# Altium project mcudevkit.PrjPcb (part 1 of 3)
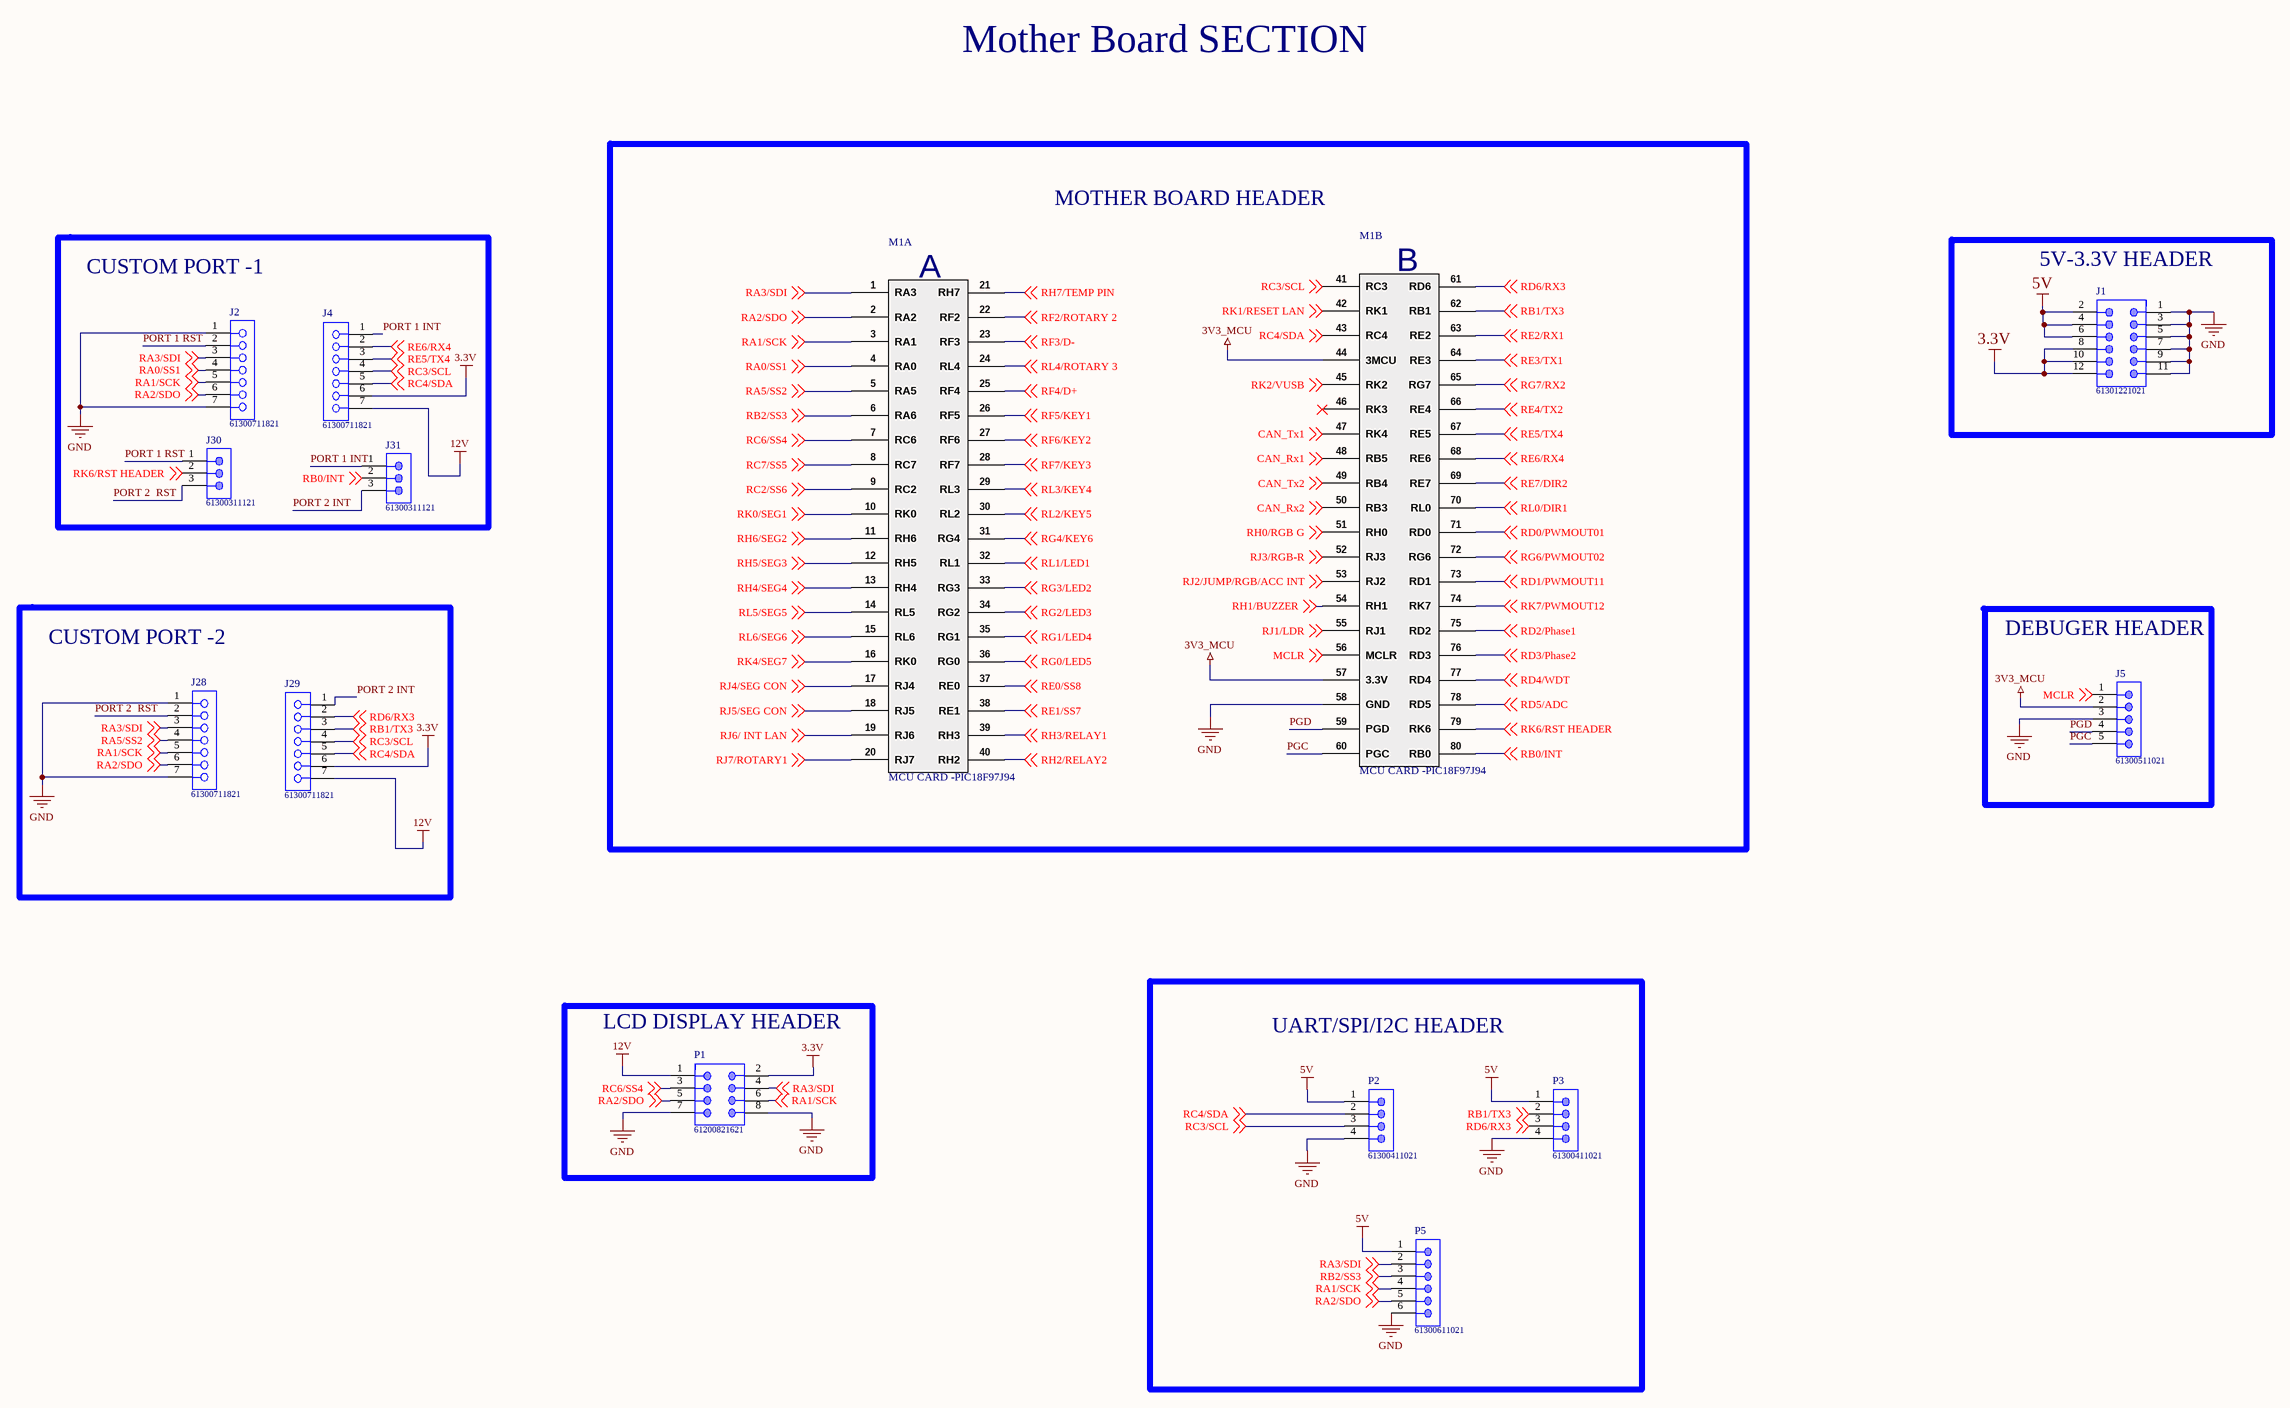
[diagram p0: Motherboard.SchDoc]
22 sheets, 236 parts. Net scope: global (net labels, ports and power ports of the same name join across sheets).
Board files: MB V2.PcbDoc, MB V3.PcbDoc, MB V7.PcbDoc
Sheets:
  Motherboard.SchDoc
  relaymodule.SchDoc
  stepper_motodriver.SchDoc
  matrixkeypad.SchDoc
  powersupply.SchDoc
  7segment.SchDoc
  Rtc.SchDoc
  Usb to Uart.SchDoc
  SPI FLASH.SchDoc
  RS-485.SchDoc
  DAC SPI.SchDoc
  Lan.SchDoc
  I2C EXTERNAL.SchDoc
  wwdt.SchDoc
  CAN.SchDoc
  DIGITAL POT.SchDoc
  Rotary Encoder.SchDoc
  USB.SchDoc
  ACCELEROMETER.SchDoc
  Current SENSOR.SchDoc
  OPAMP.SchDoc
  BARTGL.SchDoc

## Sheet Motherboard.SchDoc
size A2; SheetNumber: 1; SheetTotal: 22

### Parts
J1  61301221021  [61301221021]
J2  61300711821  [61300711821]
J4  61300711821  [61300711821]
J5  61300511021  [61300511021]
J28  61300711821  [61300711821]
J29  61300711821  [61300711821]
J30  61300311121  [61300311121]
J31  61300311121  [61300311121]
M1  MCU CARD -PIC18F97J94  [MCU-Card-PIC18f97j94]  (parts A,B of 2)
P1  61200821621  [61200821621]
P2  61300411021  [61300411021]
P3  61300411021  [61300411021]
P5  61300611021  [61300611021]

### Blocks framed on the sheet
MOTHER BOARD HEADER: M1
CUSTOM PORT -1: J2 J4 J30 J31
5V-3.3V HEADER: J1
CUSTOM PORT -2: J28 J29
DEBUGER HEADER: J5
LCD DISPLAY HEADER: P1
UART/SPI/I2C HEADER: P2 P3 P5

### Nets
3.3V: J1.8 J1.10 J1.12 J4.6 J29.6 P1.2
3V3_MCU: J5.2 M1.44(3MCU) M1.57(3.3V)
5V: J1.2 J1.4 J1.6 P2.1 P3.1 P5.1
12V: J4.7 J29.7 P1.1
GND: J1.1 J1.3 J1.5 J1.7 J1.9 J1.11 J2.1 J2.7 J5.3 J28.1 J28.7 M1.58(GND) P1.7 P1.8 P2.4 P3.4 P5.6
CAN_Rx1: M1.48(RB5) ; off-sheet CAN_Rx1
CAN_Rx2: M1.50(RB3) ; off-sheet CAN_Rx2
CAN_Tx1: M1.47(RK4) ; off-sheet CAN_Tx1
CAN_Tx2: M1.49(RB4) ; off-sheet CAN_Tx2
MCLR: J5.1 M1.56(MCLR) ; off-sheet MCLR
PGC: J5.5 M1.60(PGC)
PGD: J5.4 M1.59(PGD)
PORT 1 INT: J4.1 J31.1
PORT 1 RST: J2.2 J30.1
PORT 2  RST: J28.2 J30.3
PORT 2 INT: J29.1 J31.3
RA0/SS1: J2.4 M1.4(RA0) ; off-sheet RA0/SS1
RA1/SCK: J2.5 J28.5 M1.3(RA1) P1.6 P5.4 ; off-sheet RA1/SCK
RA2/SDO: J2.6 J28.6 M1.2(RA2) P1.5 P5.5 ; off-sheet RA2/SDO
RA3/SDI: J2.3 J28.3 M1.1(RA3) P1.4 P5.2 ; off-sheet RA3/SDI
RA5/SS2: J28.4 M1.5(RA5) ; off-sheet RA5/SS2
RB0/INT: J31.2 M1.80(RB0) ; off-sheet RB0/INT
RB1/TX3: J29.3 M1.62(RB1) P3.2 ; off-sheet RB1/TX3
RB2/SS3: M1.6(RA6) P5.3 ; off-sheet RB2/SS3
RC2/SS6: M1.9(RC2) ; off-sheet RC2/SS6
RC3/SCL: J4.4 J29.4 M1.41(RC3) P2.3 ; off-sheet RC3/SCL
RC4/SDA: J4.5 J29.5 M1.43(RC4) P2.2 ; off-sheet RC4/SDA
RC6/SS4: M1.7(RC6) P1.3 ; off-sheet RC6/SS4
RC7/SS5: M1.8(RC7) ; off-sheet RC7/SS5
RD0/PWMOUT01: M1.71(RD0) ; off-sheet RD0/PWMOUT01
RD1/PWMOUT11: M1.73(RD1) ; off-sheet RD1/PWMOUT11
RD2/Phase1: M1.75(RD2) ; off-sheet RD2/Phase1
RD3/Phase2: M1.76(RD3) ; off-sheet RD3/Phase2
RD4/WDT: M1.77(RD4) ; off-sheet RD4/WDT
RD5/ADC: M1.78(RD5) ; off-sheet RD5/ADC
RD6/RX3: J29.2 M1.61(RD6) P3.3 ; off-sheet RD6/RX3
RE0/SS8: M1.37(RE0) ; off-sheet RE0/SS8
RE1/SS7: M1.38(RE1) ; off-sheet RE1/SS7
RE2/RX1: M1.63(RE2) ; off-sheet RE2/RX1
RE3/TX1: M1.64(RE3) ; off-sheet RE3/TX1
RE4/TX2: M1.66(RE4) ; off-sheet RE4/TX2
RE5/TX4: J4.3 M1.67(RE5) ; off-sheet RE5/TX4
RE6/RX4: J4.2 M1.68(RE6) ; off-sheet RE6/RX4
RE7/DIR2: M1.69(RE7) ; off-sheet RE7/DIR2
RF2/ROTARY 2: M1.22(RF2) ; off-sheet RF2/ROTARY 2
RF3/D-: M1.23(RF3) ; off-sheet RF3/D-
RF4/D+: M1.25(RF4) ; off-sheet RF4/D+
RF5/KEY1: M1.26(RF5) ; off-sheet RF5/KEY1
RF6/KEY2: M1.27(RF6) ; off-sheet RF6/KEY2
RF7/KEY3: M1.28(RF7) ; off-sheet RF7/KEY3
RG0/LED5: M1.36(RG0) ; off-sheet RG0/LED5
RG1/LED4: M1.35(RG1) ; off-sheet RG1/LED4
RG2/LED3: M1.34(RG2) ; off-sheet RG2/LED3
RG3/LED2: M1.33(RG3) ; off-sheet RG3/LED2
RG4/KEY6: M1.31(RG4) ; off-sheet RG4/KEY6
RG6/PWMOUT02: M1.72(RG6) ; off-sheet RG6/PWMOUT02
RG7/RX2: M1.65(RG7) ; off-sheet RG7/RX2
RH0/RGB G: M1.51(RH0) ; off-sheet RH0/RGB G
RH1/BUZZER: M1.54(RH1) ; off-sheet RH1/BUZZER
RH2/RELAY2: M1.40(RH2) ; off-sheet RH2/RELAY2
RH3/RELAY1: M1.39(RH3) ; off-sheet RH3/RELAY1
RH4/SEG4: M1.13(RH4) ; off-sheet RH4/SEG4
RH5/SEG3: M1.12(RH5) ; off-sheet RH5/SEG3
RH6/SEG2: M1.11(RH6) ; off-sheet RH6/SEG2
RH7/TEMP PIN: M1.21(RH7) ; off-sheet RH7/TEMP PIN
RJ1/LDR: M1.55(RJ1) ; off-sheet RJ1/LDR
RJ2/JUMP/RGB/ACC INT: M1.53(RJ2) ; off-sheet RJ2/JUMP/RGB/ACC INT
RJ3/RGB-R: M1.52(RJ3) ; off-sheet RJ3/RGB-R
RJ4/SEG CON: M1.17(RJ4) ; off-sheet RJ4/SEG CON
RJ5/SEG CON: M1.18(RJ5) ; off-sheet RJ5/SEG CON
RJ6/ INT LAN: M1.19(RJ6) ; off-sheet RJ6/ INT LAN
RJ7/ROTARY1: M1.20(RJ7) ; off-sheet RJ7/ROTARY1
RK0/SEG1: M1.10(RK0) ; off-sheet RK0/SEG1
RK1/RESET LAN: M1.42(RK1) ; off-sheet RK1/RESET LAN
RK2/VUSB: M1.45(RK2) ; off-sheet RK2/VUSB
RK4/SEG7: M1.16(RK0) ; off-sheet RK4/SEG7
RK6/RST HEADER: J30.2 M1.79(RK6) ; off-sheet RK6/RST HEADER
RK7/PWMOUT12: M1.74(RK7) ; off-sheet RK7/PWMOUT12
RL0/DIR1: M1.70(RL0) ; off-sheet RL0/DIR1
RL1/LED1: M1.32(RL1) ; off-sheet RL1/LED1
RL2/KEY5: M1.30(RL2) ; off-sheet RL2/KEY5
RL3/KEY4: M1.29(RL3) ; off-sheet RL3/KEY4
RL4/ROTARY 3: M1.24(RL4) ; off-sheet RL4/ROTARY 3
RL5/SEG5: M1.14(RL5) ; off-sheet RL5/SEG5
RL6/SEG6: M1.15(RL6) ; off-sheet RL6/SEG6

Not connected (* = marked no-connect by the designer): M1 46(RK3)*

### Notes on the sheet
- Mother Board SECTION
- (in symbol MCU CARD -PIC18F97J94, part A) A
- (in symbol MCU CARD -PIC18F97J94, part B) B

### Library data of the parts
J1 = 61301221021: WR-PHD Pin Header, THT, pitch 2.54mm, Dual Row, Angled, 12pin; Pin Number: 12; Gender: Male; Rated Current: 3A; Working Voltage: 250VAC; Withstanding Voltage: 500VAC; Contact Resistance: 20mOhm; ComponentLink1Description: Manufacturer; ComponentLink1URL: http://www.we-online.de; ComponentLink2Description: Datasheet; ComponentLink2URL: https://katalog.we-online.de/em/datasheet/6130xx21021.pdf; Part Number: 61301221021; Published Date: June 2019; Publisher: Wurth Elektronik; Pitch: 2.54mm; Operating Temperature: -40 to +105degC; Mounting Technology: THT; Packaging: Bag; Row Number: Dual; Orientation: Angled
J2 J4 J28 J29 = 61300711821: WR-PHD Socket Header, THT, pitch 2.54mm, Single Row, Vertical, 7pin; Pin Number: 7; Gender: Female; Rated Current: 3A; Working Voltage: 250VAC; Withstanding Voltage: 500VAC; Contact Resistance: 20mOhm; ComponentLink1Description: Manufacturer; ComponentLink1URL: http://www.we-online.de; ComponentLink2Description: Datasheet; ComponentLink2URL: https://katalog.we-online.de/em/datasheet/6130xx11821.pdf; Part Number: 61300711821; Published Date: June 2019; Publisher: Wurth Elektronik; Pitch: 2.54mm; Operating Temperature: -40 to +125degC; Mounting Technology: THT; Packaging: Tray; Row Number: Single; Orientation: Vertical
J5 = 61300511021: WR-PHD Pin Header, THT, pitch 2.54mm, Single Row, Angled, 5pin; Pin Number: 5; Gender: Male; Rated Current: 3A; Working Voltage: 250VAC; Withstanding Voltage: 500VAC; Contact Resistance: 20mOhm; ComponentLink1Description: Manufacturer; ComponentLink1URL: http://www.we-online.de; ComponentLink2Description: Datasheet; ComponentLink2URL: https://katalog.we-online.de/em/datasheet/6130xx11021.pdf; Part Number: 61300511021; Published Date: June 2019; Publisher: Wurth Elektronik; Pitch: 2.54mm; Operating Temperature: -40 to +105degC; Mounting Technology: THT; Packaging: Bag; Row Number: Single; Orientation: Angled
J30 J31 = 61300311121: WR-PHD Pin Header, THT, pitch 2.54mm, Single Row, Vertical, 3pin; Pin Number: 3; Gender: Male; Rated Current: 3A; Working Voltage: 250VAC; Withstanding Voltage: 500VAC; Contact Resistance: 20mOhm; ComponentLink1Description: Manufacturer; ComponentLink1URL: http://www.we-online.de; ComponentLink2Description: Datasheet; ComponentLink2URL: https://katalog.we-online.de/em/datasheet/6130xx11121.pdf; Part Number: 61300311121; Published Date: June 2019; Publisher: Wurth Elektronik; Pitch: 2.54mm; Operating Temperature: -40 to +105degC; Mounting Technology: THT; Packaging: Bag; Row Number: Single; Orientation: Vertical
M1 = MCU CARD -PIC18F97J94: MCU CARD -PIC18F97J94 FOR mother board
P1 = 61200821621: Male Box Header WR-BHD, THT, Vertical, pitch 2.54 mm, 8 pins; Pitch: 2.54 mm; Working Voltage: 250 VAC; Withstanding Voltage: 500 VAC; Contact Resistance: 20 mOhm; Pin Number: 8; ComponentLink1Description: Manufacturer; ComponentLink1URL: http://www.we-online.de; ComponentLink2Description: Datasheet; ComponentLink2URL: https://katalog.we-online.de/em/datasheet/6120xx21621.pdf; Part Number: 61200821621; Published Date: August 2018; Publisher: Wurth Elektronik; Operating Temperature: -40 to 125 degC; Packaging: Tray; Gender: Male; Mounting Technology: THT; Orientation: Vertical
P2 P3 = 61300411021: WR-PHD Pin Header, THT, pitch 2.54mm, Single Row, Angled, 4pin; Pin Number: 4; Gender: Male; Rated Current: 3A; Working Voltage: 250VAC; Withstanding Voltage: 500VAC; Contact Resistance: 20mOhm; ComponentLink1Description: Manufacturer; ComponentLink1URL: http://www.we-online.de; ComponentLink2Description: Datasheet; ComponentLink2URL: https://katalog.we-online.de/em/datasheet/6130xx11021.pdf; Part Number: 61300411021; Published Date: June 2019; Publisher: Wurth Elektronik; Pitch: 2.54mm; Operating Temperature: -40 to +105degC; Mounting Technology: THT; Packaging: Bag; Row Number: Single; Orientation: Angled
P5 = 61300611021: WR-PHD Pin Header, THT, pitch 2.54mm, Single Row, Angled, 6pin; Pin Number: 6; Gender: Male; Rated Current: 3A; Working Voltage: 250VAC; Withstanding Voltage: 500VAC; Contact Resistance: 20mOhm; ComponentLink1Description: Manufacturer; ComponentLink1URL: http://www.we-online.de; ComponentLink2Description: Datasheet; ComponentLink2URL: https://katalog.we-online.de/em/datasheet/6130xx11021.pdf; Part Number: 61300611021; Published Date: June 2019; Publisher: Wurth Elektronik; Pitch: 2.54mm; Operating Temperature: -40 to +105degC; Mounting Technology: THT; Packaging: Bag; Row Number: Single; Orientation: Angled

## Sheet relaymodule.SchDoc
size 250 x 250 mm; SheetNumber: 2; SheetTotal: 22
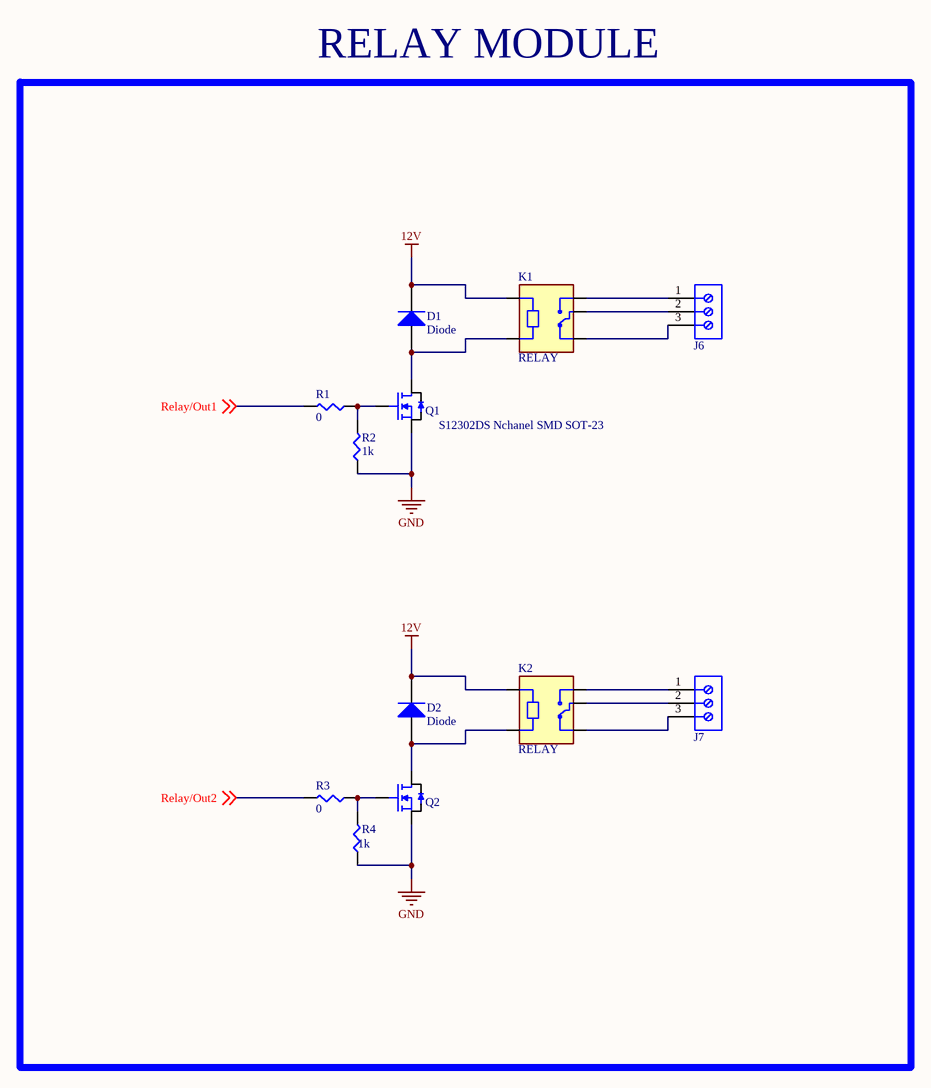
[diagram p1: relaymodule.SchDoc]

### Parts
D1  Diode  [SMC]
D2  Diode  [SMC]
J6  691101710003  [691101710003]  (value not drawn)
J7  691101710003  [691101710003]  (value not drawn)
K1  RELAY  [RELAY]
K2  RELAY  [RELAY]
Q1  S12302DS Nchanel SMD SOT-23  [SOT-23-3N]
Q2  S12302DS Nchanel SMD SOT-23  [SOT-23-3N]  (value not drawn)
R1  0  [SMD-0805-RES]
R2  1k  [SMD-0805-RES]
R3  0  [SMD-0805-RES]
R4  1k  [SMD-0805-RES]

### Blocks framed on the sheet
RELAY MODULE: D1 D2 J6 J7 K1 K2 Q1 Q2 R1-R4

### Nets
12V: D1.2(K) D2.2(K) K1.A1 K2.A1
GND: Q1.2(Source) Q2.2(Source) R2.1 R4.1
Relay/Out1: R1.2 ; off-sheet Relay/Out1
Relay/Out2: R3.2 ; off-sheet Relay/Out2
NetD1_1: D1.1(A) K1.A2 Q1.3(Drain)
NetD2_1: D2.1(A) K2.A2 Q2.3(Drain)
NetJ6_1: J6.1 K1.NO
NetJ6_2: J6.2 K1.COM
NetJ6_3: J6.3 K1.NC
NetJ7_1: J7.1 K2.NO
NetJ7_2: J7.2 K2.COM
NetJ7_3: J7.3 K2.NC
NetQ1_1: Q1.1(Gate) R1.1 R2.2
NetQ2_1: Q2.1(Gate) R3.1 R4.2

### Library data of the parts
D1 D2 = Diode: Default Diode; Published: 8-Jun-2000; LatestRevisionDate: 17-Jul-2002; LatestRevisionNote: Re-released for DXP Platform.; PackageVersion: Sep-1996; PackageReference: SMC; Publisher: Altium Limited; PackageDescription: DO-214-AB/SMC; 2 C-Bend Leads; Body 7.9 x 5.9 mm, inc. leads (LxW); Code_JEDEC: DO-214-AB
J6 J7 = 691101710003: WR-TBL Series 101 Horizontal Entry Modular, THT, pitch 5mm, 3p; Manufacturer: Wurth Elektronik; Modularity: Yes; Rated Current: 16A; Working Voltage: 250V; ComponentLink1Description: Website Link; ComponentLink1URL: https://www.we-online.com/redexpert/article/691101710003?ad; ComponentLink2Description: Datasheet Link; ComponentLink2URL: https://www.we-online.com/redexpert/spec/691101710003?ad; Manufacturer Part Number: 691101710003; Category: Terminal Blocks; Match Code: WR-TBL; Mount: Through Hole; Operating Temperature Max: 105°C; Operating Temperature Min: -40°C; Packaging: Box; Application: Pressure Clamp; Number of Pins: 3; Number of Rows: 1; Orientation: Horizontal; Pitch: 5mm
Q1 Q2 = S12302DS: S12302DS Nchanel SMD SOT-23. VDS MAX 20. 400Ma DI
R1 R3 = ERJ-6ENF1001V: RES SMD 1K OHM 1% 1/8W 0805; Manufacturer: Panasonic Electronic Components; Unit Price (USD): 0.00729; @ qty: 1500; Minimum Quantity: 1; Power (Watts): 0.125W, 1/8W; Temperature Coefficient: ±100ppm/°C; Part Number: ERJ-6ENF1001V; Datasheets: http://industrial.panasonic.com/www-cgi/jvcr13pz.cgi?E+PZ+3+AOA0002+ERJ6ENF1001V+7+WW; Image: //media.digikey.com/Renders/Panasonic%20Renders/ERJ-0805%20Pkg.jpg; Digi-Key Part Number: P1.00KCCT-ND; Quantity Available: 12895103; Factory Stock: 0; Packaging: Cut Tape (CT); Series: ERJ; Part Status: Active; Value: 1k; Tolerance: ±1%; Composition: Thick Film; Features: Automotive AEC-Q200; Operating Temperature: -55°C ~ 155°C; Package / Case: 0805 (2012 Metric); Supplier Device Package: 0805; Size / Dimension: 0.079" L x 0.049" W (2.00mm x 1.25mm); Height - Seated (Max): 0.028" (0.70mm); Number of Terminations: 2; Failure Rate: -
R2 R4 = ERJ-6ENF1001V: RES SMD 1K OHM 1% 1/8W 0805; Manufacturer: Panasonic Electronic Components; Factory Stock: 0; Unit Price (USD): 0.00729; @ qty: 1500; Minimum Quantity: 1; Power (Watts): 0.125W, 1/8W; Temperature Coefficient: ±100ppm/°C; Part Number: ERJ-6ENF1001V; Datasheets: http://industrial.panasonic.com/www-cgi/jvcr13pz.cgi?E+PZ+3+AOA0002+ERJ6ENF1001V+7+WW; Image: //media.digikey.com/Renders/Panasonic%20Renders/ERJ-0805%20Pkg.jpg; Digi-Key Part Number: P1.00KCCT-ND; Quantity Available: 12895103; Packaging: Cut Tape (CT); Series: ERJ; Part Status: Active; Value: 1k; Tolerance: ±1%; Composition: Thick Film; Features: Automotive AEC-Q200; Operating Temperature: -55°C ~ 155°C; Package / Case: 0805 (2012 Metric); Supplier Device Package: 0805; Size / Dimension: 0.079" L x 0.049" W (2.00mm x 1.25mm); Height - Seated (Max): 0.028" (0.70mm); Number of Terminations: 2; Failure Rate: -

## Sheet stepper_motodriver.SchDoc
size A4; SheetNumber: 3; SheetTotal: 22
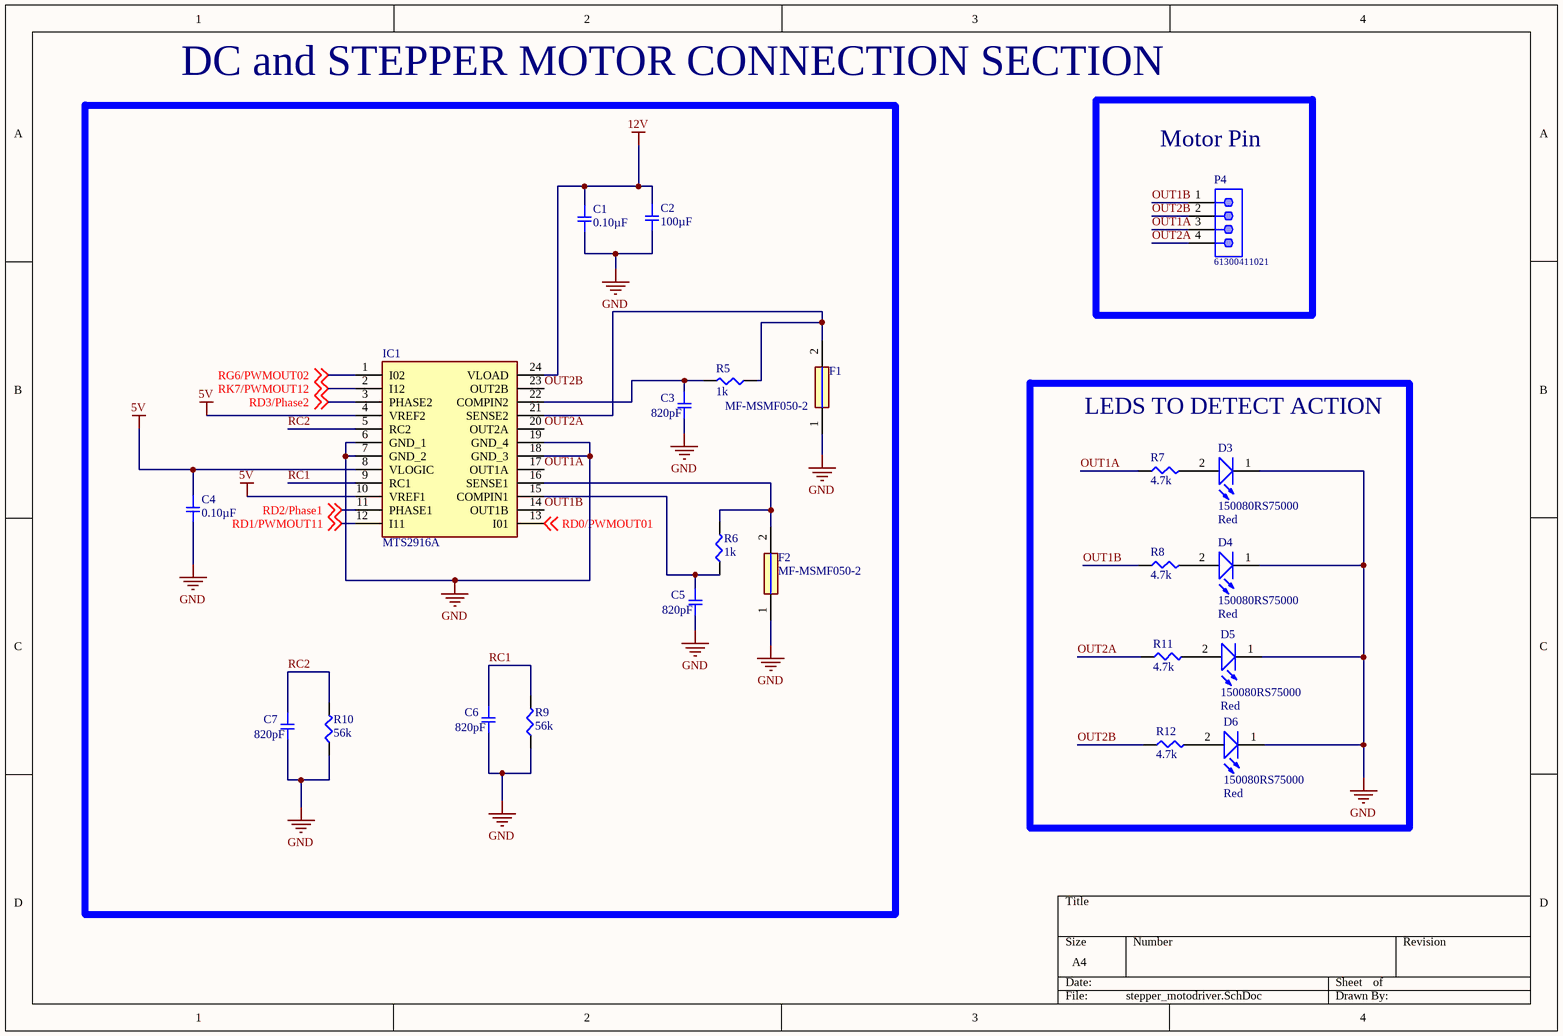
[diagram p2: stepper_motodriver.SchDoc]

### Parts
C1  0.10µF  [SMD-0805C]
C2  100µF  [SMD-0805C]
C3  820pF  [SMD-0805C]
C4  0.10µF  [SMD-0805C]
C5  820pF  [SMD-0805C]
C6  820pF  [SMD-0805C]
C7  820pF  [SMD-0805C]
D3  150080RS75000  Emitting Color: Red  [WL-SMCW_0805]
D4  150080RS75000  Emitting Color: Red  [WL-SMCW_0805]
D5  150080RS75000  Emitting Color: Red  [WL-SMCW_0805]
D6  150080RS75000  Emitting Color: Red  [WL-SMCW_0805]
F1  MF-MSMF050-2  [FUSC4632X85N]
F2  MF-MSMF050-2  [FUSC4632X85N]
IC1  MTS2916A  [SOIC127P1046X264-24N]
P4  61300411021  [61300411021]
R5  1k  [SMD-0805-RES]
R6  1k  [SMD-0805-RES]
R7  4.7k  [SMD-0805-RES]
R8  4.7k  [SMD-0805-RES]
R9  56k  [SMD-0805-RES]
R10  56k  [SMD-0805-RES]
R11  4.7k  [SMD-0805-RES]
R12  4.7k  [SMD-0805-RES]

### Blocks framed on the sheet
DC and STEPPER MOTOR CONNECTION SECTION: C1-C7 F1 F2 IC1 R5 R6 R9 R10
Motor Pin: P4
LEDS TO DETECT ACTION: D3-D6 R7 R8 R11 R12

### Nets
5V: C4.1 IC1.4(VREF2) IC1.8(VLOGIC) IC1.10(VREF1)
12V: C1.1 C2.1 IC1.24(VLOAD)
GND: C1.2 C2.2 C3.2 C4.2 C5.2 C6.2 C7.2 D3.1(K) D4.1(K) D5.1(K) D6.1(K) F1.1 F2.1 IC1.6(GND_1) IC1.7(GND_2) IC1.18(GND_3) IC1.19(GND_4) R9.1 R10.1
OUT1A: IC1.17(OUT1A) P4.3 R7.1
OUT1B: IC1.14(OUT1B) P4.1 R8.1
OUT2A: IC1.20(OUT2A) P4.4 R11.1
OUT2B: IC1.23(OUT2B) P4.2 R12.1
RC1: C6.1 IC1.9(RC1) R9.2
RC2: C7.1 IC1.5(RC2) R10.2
RD0/PWMOUT01: IC1.13(I01) ; off-sheet RD0/PWMOUT01
RD1/PWMOUT11: IC1.12(I11) ; off-sheet RD1/PWMOUT11
RD2/Phase1: IC1.11(PHASE1) ; off-sheet RD2/Phase1
RD3/Phase2: IC1.3(PHASE2) ; off-sheet RD3/Phase2
RG6/PWMOUT02: IC1.1(I02) ; off-sheet RG6/PWMOUT02
RK7/PWMOUT12: IC1.2(I12) ; off-sheet RK7/PWMOUT12
NetC3_1: C3.1 IC1.22(COMPIN2) R5.2
NetC5_1: C5.1 IC1.15(COMPIN1) R6.1
NetD3_2: D3.2(A) R7.2
NetD4_2: D4.2(A) R8.2
NetD5_2: D5.2(A) R11.2
NetD6_2: D6.2(A) R12.2
NetF1_2: F1.2 IC1.21(SENSE2) R5.1
NetF2_2: F2.2 IC1.16(SENSE1) R6.2

### Library data of the parts
C1 C4 = GCD21BR71H104KA01L: CAP CER 0.1UF 50V X7R 0805; Manufacturer: Murata Electronics North America; Factory Stock: 0; Unit Price (USD): 0.24; Minimum Quantity: 1; Tolerance: ±10%; Datasheets: http://www.murata.com/~/media/webrenewal/support/library/catalog/products/capacitor/mlcc/c03e.ashx; Image: //media.digikey.com/Renders/Murata%20Renders/0805%28GxM6%29.jpg; Digi-Key Part Number: 490-11955-1-ND; Part Number: GCD21BR71H104KA01L; Quantity Available: 157; @ qty: 0; Packaging: Cut Tape (CT); Series: GCD; Part Status: Active; Value: 0.10µF; Voltage: 50V; Temperature Coefficient: X7R; Operating Temperature: -55°C ~ 125°C; Features: -; Ratings: AEC-Q200; Applications: Automotive; Mounting Type: Surface Mount, MLCC; Package / Case: 0805 (2012 Metric); Size / Dimension: 0.079" L x 0.049" W (2.00mm x 1.25mm); Height - Seated (Max): -; Thickness (Max): 0.049" (1.25mm); Lead Spacing: -; Lead Style: -
C2 = GRM21BR60J107ME15L: CAP CER 100UF 6.3V X5R 0805; Manufacturer: Murata Electronics North America; Factory Stock: 0; Unit Price (USD): 2.17; Minimum Quantity: 1; Tolerance: ±20%; Datasheets: http://search.murata.co.jp/Ceramy/image/img/A01X/G101/ENG/GRM21BR60J107ME15-01.pdf; Image: //media.digikey.com/Renders/Murata%20Renders/0805%20(2012%20Metric)%20.85mm.jpg; Digi-Key Part Number: 490-13981-1-ND; Part Number: GRM21BR60J107ME15L; Quantity Available: 4815; @ qty: 0; Packaging: Cut Tape (CT); Series: GRM; Part Status: Active; Value: 100µF; Voltage: 6.3V; Temperature Coefficient: X5R; Operating Temperature: -55°C ~ 85°C; Features: -; Ratings: -; Applications: General Purpose; Mounting Type: Surface Mount, MLCC; Package / Case: 0805 (2012 Metric); Size / Dimension: 0.079" L x 0.049" W (2.00mm x 1.25mm); Height - Seated (Max): -; Thickness (Max): 0.057" (1.45mm); Lead Spacing: -; Lead Style: -
C3 C5-C7 = GRM2165C1H821JA01D: CAP CER 820PF 50V NP0 0805; Manufacturer: Murata Electronics North America; Factory Stock: 0; Unit Price (USD): 0.21; Minimum Quantity: 1; Tolerance: ±5%; Temperature Coefficient: C0G, NP0; Datasheets: http://www.murata.com/~/media/webrenewal/support/library/catalog/products/capacitor/mlcc/c02e.pdf; Image: //media.digikey.com/Renders/Murata%20Renders/0805%20(2012%20Metric)%20.85mm.jpg; Digi-Key Part Number: 490-11551-1-ND; Part Number: GRM2165C1H821JA01D; Quantity Available: 17274; @ qty: 0; Packaging: Cut Tape (CT); Series: GRM; Part Status: Active; Value: 820pF; Voltage: 50V; Operating Temperature: -55°C ~ 125°C; Features: -; Ratings: -; Applications: General Purpose; Mounting Type: Surface Mount, MLCC; Package / Case: 0805 (2012 Metric); Size / Dimension: 0.079" L x 0.049" W (2.00mm x 1.25mm); Height - Seated (Max): -; Thickness (Max): 0.028" (0.70mm); Lead Spacing: -; Lead Style: -
D3-D6 = 150080RS75000: WL-SMCW SMD Mono-color Chip LED Waterclear, size 0805, Red; Forward Voltage: 2 V; Viewing Angle: 140°; Peak Wavelength: 630 nm; Published Date: Jan 2017; Publisher: Wurth Elektronik; ComponentLink1Description: Manufacturer; ComponentLink1URL: http://www.we-online.de; ComponentLink2Description: Datasheet; ComponentLink2URL: http://katalog.we-online.de/led/datasheet/150080RS75000.pdf; Part Number: 150080RS75000; Size: 0805
F1 F2 = MF-MSMF050-2: Fuse; Manufacturer_Name: Bourns; Datasheet Link: https://www.bourns.com/pdfs/mfmsmf.pdf; Manufacturer_Part_Number: MF-MSMF050-2; Mouser Part Number: 652-MF-MSMF050-2; Mouser Price/Stock: https://www.mouser.co.uk/ProductDetail/Bourns/MF-MSMF050-2?qs=t3shhpq1i1DZ7OBD5kLNoA%3D%3D; Arrow Part Number: MF-MSMF050-2; Arrow Price/Stock: https://www.arrow.com/en/products/mf-msmf050-2/bourns?region=europe
IC1 = MTS2916A-HGC1: Integrated Circuit; Manufacturer_Name: Microchip; Datasheet Link: http://ww1.microchip.com/downloads/en/DeviceDoc/22259C.pdf; Height: 2.642mm; Manufacturer_Part_Number: MTS2916A-HGC1; Mouser Part Number: 579-MTS2916A-HGC1; Mouser Price/Stock: https://www.mouser.co.uk/ProductDetail/Microchip-Technology/MTS2916A-HGC1?qs=gdymDg%2FOn%252BFGBMeCto2zTQ%3D%3D; Arrow Part Number: MTS2916A-HGC1; Arrow Price/Stock: https://www.arrow.com/en/products/mts2916a-hgc1/microchip-technology?region=nac
P4 = 61300411021: as P2 on sheet Motherboard; ComponentLink1Description: Manufacturer; ComponentLink1URL: http://www.we-online.de; ComponentLink2Description: Datasheet; ComponentLink2URL: https://katalog.we-online.de/em/datasheet/6130xx11021.pdf; Part Number: 61300411021; Published Date: June 2019; Publisher: Wurth Elektronik; Pitch: 2.54mm; Operating Temperature: -40 to +105degC; Mounting Technology: THT; Packaging: Bag; Row Number: Single; Orientation: Angled
R5 R6 = ERJ-6ENF1001V: as R2 on sheet relaymodule; Part Number: ERJ-6ENF1001V; Datasheets: http://industrial.panasonic.com/www-cgi/jvcr13pz.cgi?E+PZ+3+AOA0002+ERJ6ENF1001V+7+WW; Image: //media.digikey.com/Renders/Panasonic%20Renders/ERJ-0805%20Pkg.jpg; Digi-Key Part Number: P1.00KCCT-ND; Quantity Available: 12895103; Packaging: Cut Tape (CT); Series: ERJ; Part Status: Active; Value: 1k; Tolerance: ±1%; Composition: Thick Film; Features: Automotive AEC-Q200; Operating Temperature: -55°C ~ 155°C; Package / Case: 0805 (2012 Metric); Supplier Device Package: 0805; Size / Dimension: 0.079" L x 0.049" W (2.00mm x 1.25mm); Height - Seated (Max): 0.028" (0.70mm); Number of Terminations: 2; Failure Rate: -
R7 R8 R11 R12 = ERJ-6GEYJ472V: RES SMD 4.7K OHM 5% 1/8W 0805; Manufacturer: Panasonic Electronic Components; Factory Stock: 0; Unit Price (USD): 0.00496; @ qty: 1500; Minimum Quantity: 1; Power (Watts): 0.125W, 1/8W; Temperature Coefficient: ±200ppm/°C; Part Number: ERJ-6GEYJ472V; Datasheets: http://industrial.panasonic.com/www-cgi/jvcr13pz.cgi?E+PZ+3+AOA0001+ERJ6GEYJ472V+7+WW; Image: //media.digikey.com/Renders/Panasonic%20Renders/ERJ-0805%20Pkg.jpg; Digi-Key Part Number: P4.7KACT-ND; Quantity Available: 392030; Packaging: Cut Tape (CT); Series: ERJ; Part Status: Active; Value: 4.7k; Tolerance: ±5%; Composition: Thick Film; Features: Automotive AEC-Q200; Operating Temperature: -55°C ~ 155°C; Package / Case: 0805 (2012 Metric); Supplier Device Package: 0805; Size / Dimension: 0.079" L x 0.049" W (2.00mm x 1.25mm); Height - Seated (Max): 0.028" (0.70mm); Number of Terminations: 2; Failure Rate: -
R9 R10 = ERJ-6ENF5602V: RES SMD 56K OHM 1% 1/8W 0805; Manufacturer: Panasonic Electronic Components; Factory Stock: 0; Unit Price (USD): 0.00729; @ qty: 1500; Minimum Quantity: 1; Power (Watts): 0.125W, 1/8W; Temperature Coefficient: ±100ppm/°C; Part Number: ERJ-6ENF5602V; Datasheets: http://industrial.panasonic.com/www-cgi/jvcr13pz.cgi?E+PZ+3+AOA0002+ERJ6ENF5602V+7+WW; Image: //media.digikey.com/Renders/Panasonic%20Renders/ERJ-0805%20Pkg.jpg; Digi-Key Part Number: P56.0KCCT-ND; Quantity Available: 45768; Packaging: Cut Tape (CT); Series: ERJ; Part Status: Active; Value: 56k; Tolerance: ±1%; Composition: Thick Film; Features: Automotive AEC-Q200; Operating Temperature: -55°C ~ 155°C; Package / Case: 0805 (2012 Metric); Supplier Device Package: 0805; Size / Dimension: 0.079" L x 0.049" W (2.00mm x 1.25mm); Height - Seated (Max): 0.028" (0.70mm); Number of Terminations: 2; Failure Rate: -

## Sheet matrixkeypad.SchDoc
size A4; SheetNumber: 4; SheetTotal: 22
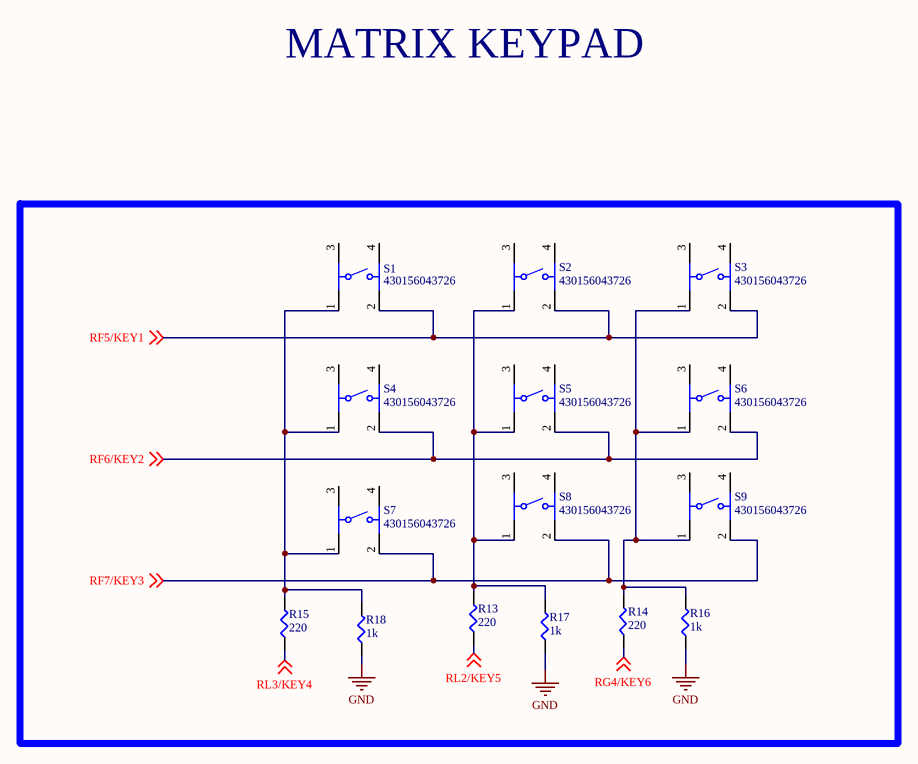
[diagram p3: matrixkeypad.SchDoc]

### Parts
R13  220  [SMD-0805-RES]
R14  220  [SMD-0805-RES]
R15  220  [SMD-0805-RES]
R16  1k  [SMD-0805-RES]
R17  1k  [SMD-0805-RES]
R18  1k  [SMD-0805-RES]
S1  430156043726  [4301x60437x6]
S2  430156043726  [4301x60437x6]
S3  430156043726  [4301x60437x6]
S4  430156043726  [4301x60437x6]
S5  430156043726  [4301x60437x6]
S6  430156043726  [4301x60437x6]
S7  430156043726  [4301x60437x6]
S8  430156043726  [4301x60437x6]
S9  430156043726  [4301x60437x6]

### Nets
GND: R16.1 R17.1 R18.1
RF5/KEY1: S1.2 S2.2 S3.2 ; off-sheet RF5/KEY1
RF6/KEY2: S4.2 S5.2 S6.2 ; off-sheet RF6/KEY2
RF7/KEY3: S7.2 S8.2 S9.2 ; off-sheet RF7/KEY3
RG4/KEY6: R14.1 ; off-sheet RG4/KEY6
RL2/KEY5: R13.1 ; off-sheet RL2/KEY5
RL3/KEY4: R15.1 ; off-sheet RL3/KEY4
NetR13_2: R13.2 R17.2 S2.1 S5.1 S8.1
NetR14_2: R14.2 R16.2 S3.1 S6.1 S9.1
NetR15_2: R15.2 R18.2 S1.1 S4.1 S7.1

Not connected (* = marked no-connect by the designer): S1 3 4; S2 3 4; S3 3 4; S4 3 4; S5 3 4; S6 3 4; S7 3 4; S8 3 4; S9 3 4

### Notes on the sheet
- MATRIX KEYPAD

### Library data of the parts
R13-R15 = ERJ-6ENF2200V: RES SMD 220 OHM 1% 1/8W 0805; Manufacturer: Panasonic Electronic Components; Factory Stock: 0; Unit Price (USD): 0.00729; @ qty: 1500; Minimum Quantity: 1; Power (Watts): 0.125W, 1/8W; Temperature Coefficient: ±100ppm/°C; Part Number: ERJ-6ENF2200V; Datasheets: http://industrial.panasonic.com/www-cgi/jvcr13pz.cgi?E+PZ+3+AOA0002+ERJ6ENF2200V+7+WW; Image: //media.digikey.com/Renders/Panasonic%20Renders/ERJ-0805%20Pkg.jpg; Digi-Key Part Number: P220CCT-ND; Quantity Available: 111570; Packaging: Cut Tape (CT); Series: ERJ; Part Status: Active; Value: 220; Tolerance: ±1%; Composition: Thick Film; Features: Automotive AEC-Q200; Operating Temperature: -55°C ~ 155°C; Package / Case: 0805 (2012 Metric); Supplier Device Package: 0805; Size / Dimension: 0.079" L x 0.049" W (2.00mm x 1.25mm); Height - Seated (Max): 0.028" (0.70mm); Number of Terminations: 2; Failure Rate: -
R16-R18 = ERJ-6ENF1001V: as R2 on sheet relaymodule; Part Number: ERJ-6ENF1001V; Datasheets: http://industrial.panasonic.com/www-cgi/jvcr13pz.cgi?E+PZ+3+AOA0002+ERJ6ENF1001V+7+WW; Image: //media.digikey.com/Renders/Panasonic%20Renders/ERJ-0805%20Pkg.jpg; Digi-Key Part Number: P1.00KCCT-ND; Quantity Available: 12895103; Packaging: Cut Tape (CT); Series: ERJ; Part Status: Active; Value: 1k; Tolerance: ±1%; Composition: Thick Film; Features: Automotive AEC-Q200; Operating Temperature: -55°C ~ 155°C; Package / Case: 0805 (2012 Metric); Supplier Device Package: 0805; Size / Dimension: 0.079" L x 0.049" W (2.00mm x 1.25mm); Height - Seated (Max): 0.028" (0.70mm); Number of Terminations: 2; Failure Rate: -
S1-S9 = 430156043726: WS-TATV THT Tact Switch 6x6mm, height 4.3mm, 260gf; Rated Voltage: 12VDC; Rated Current: 50mA; Washable: No; ComponentLink1Description: Manufacturer; ComponentLink1URL: http://www.we-online.de; ComponentLink2Description: Datasheet; ComponentLink2URL: https://katalog.we-online.com/em/datasheet/430156043726.pdf; Operating Temperature: -40 to +85degC; Part Number: 430156043726; Published Date: September 2019; Contact Material: Stainless Steel; Height: 4.3mm; Mounting Technology: THT; Contact Plating: Silver; Operation Force: 260gf; Packaging: Bulk; Terminal Material: Copper Alloy; Publisher: Wurth Elektronik; Terminal Plating: Silver

## Sheet powersupply.SchDoc
size A4; SheetNumber: 5; SheetTotal: 22
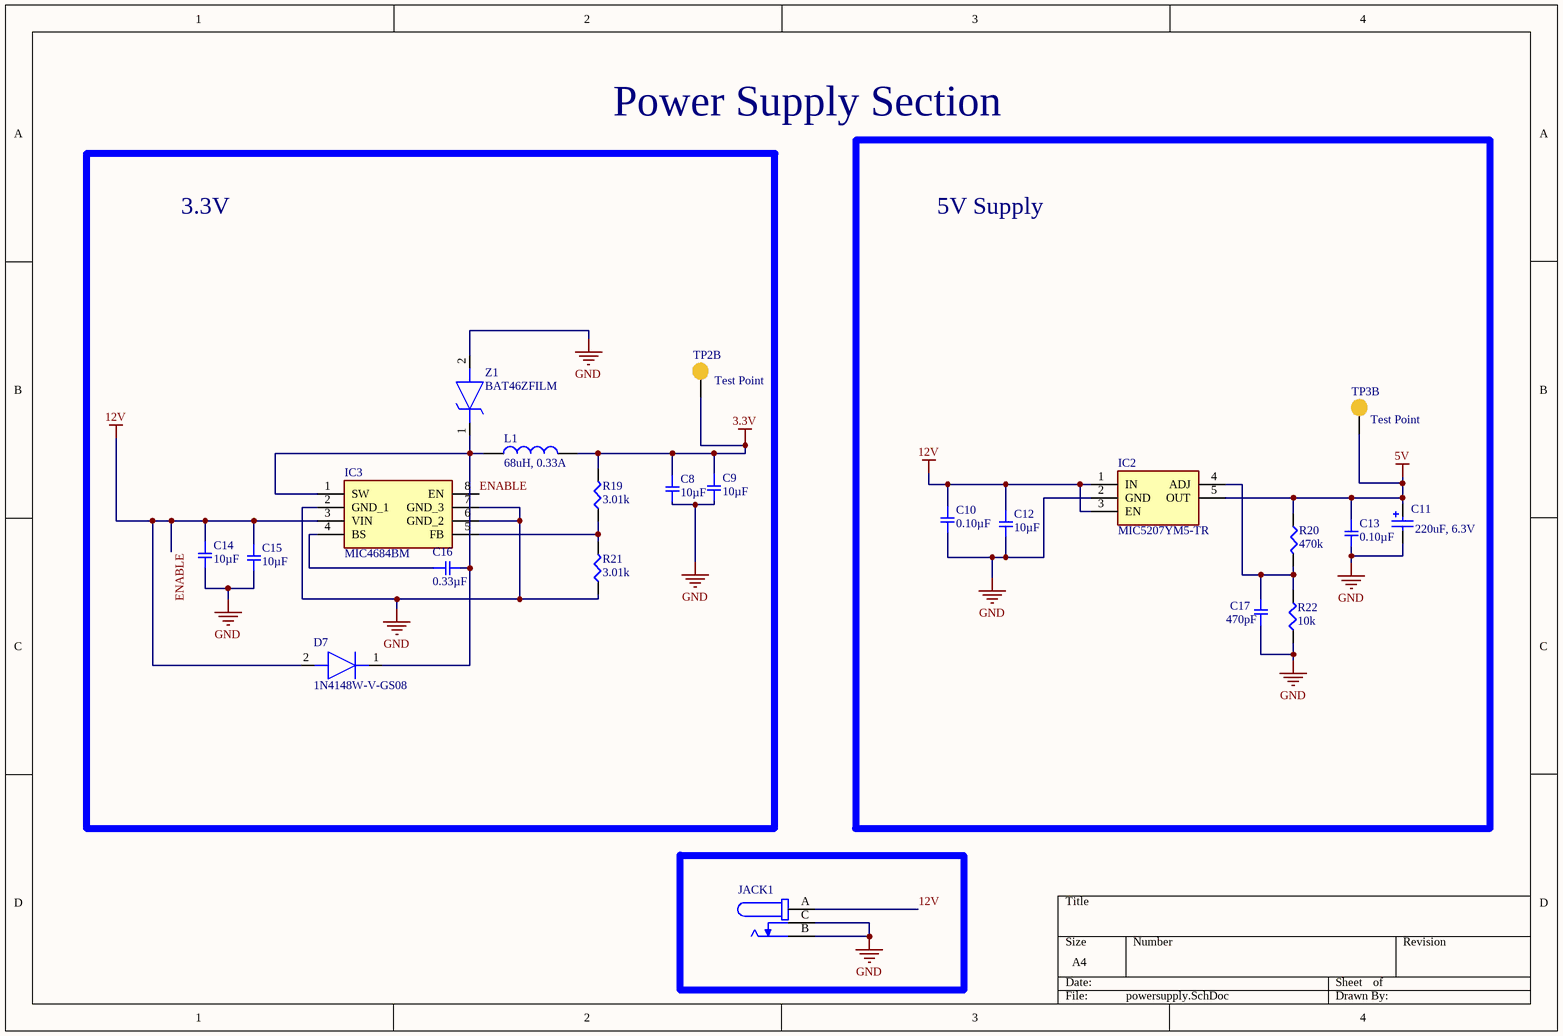
[diagram p4: powersupply.SchDoc]

### Parts
C8  10µF  [SMD-0805C]
C9  10µF  [SMD-0805C]
C10  0.10µF  [SMD-0805C]
C11  220uF, 6.3V  [WCAP-ASLI_6.3x5.5]
C12  10µF  [SMD-0805C]
C13  0.10µF  [SMD-0805C]
C14  10µF  [SMD-0805C]
C15  10µF  [SMD-0805C]
C16  0.33µF  [SMD-0805C]
C17  470pF  [SMD-0805C]
D7  1N4148W-V-GS08  [1N4148WVGS08]
IC2  MIC5207YM5-TR  [SOT95P280X130-5N]
IC3  MIC4684BM  [SOIC127P602X173-8N]
JACK1  JACK  [JACK]  (value not drawn)
L1  68uH, 0.33A  [WE-LQ_1812]
R19  3.01k  [SMD-0805-RES]
R20  470k  [SMD-0805-RES]
R21  3.01k  [SMD-0805-RES]
R22  10k  [SMD-0805-RES]
TP2  Test Point  [pad2]  (part B of 2)
TP3  Test Point  [pad2]  (part B of 2)
Z1  BAT46ZFILM  [STPS0560Z]

### Blocks framed on the sheet
3.3V: C8 C9 C14-C16 D7 IC3 L1 R19 R21 TP2 Z1
5V Supply: C10-C13 C17 IC2 R20 R22 TP3

### Nets
3.3V: C8.1 C9.1 L1.2 R19.2 TP2.1
5V: C11.2(P) C13.1 IC2.5(OUT) R20.1 TP3.1
12V: C10.1 C12.1 C14.1 C15.1 D7.2(A) IC2.1(IN) IC2.3(EN) IC3.3(VIN) IC3.8(EN) JACK1.A  [also labelled ENABLE]
GND: C8.2 C9.2 C10.2 C11.1(N) C12.2 C13.2 C14.2 C15.2 C17.1 IC2.2(GND) IC3.2(GND_1) IC3.6(GND_2) IC3.7(GND_3) JACK1.B JACK1.C R21.1 R22.1 Z1.2(A)
NetC16_1: C16.1 IC3.4(BS)
NetC16_2: C16.2 D7.1(K) IC3.1(SW) L1.1 Z1.1(K)
NetC17_2: C17.2 IC2.4(ADJ) R20.2 R22.2
NetIC3_5: IC3.5(FB) R19.1 R21.2

### Notes on the sheet
- Power Supply Section

### Library data of the parts
C8 C9 C12 C14 C15 = GCJ21BR71A106KE01L: CAP CER 10UF 10V X7R 0805; Manufacturer: Murata Electronics North America; Factory Stock: 0; Unit Price (USD): 0.56; Minimum Quantity: 1; Tolerance: ±10%; Datasheets: http://www.murata.com/~/media/webrenewal/support/library/catalog/products/capacitor/mlcc/c03e.ashx; Image: //media.digikey.com/Renders/Murata%20Renders/0805%20(2012%20Metric)%20.85mm.jpg; Digi-Key Part Number: 490-12646-1-ND; Part Number: GCJ21BR71A106KE01L; Quantity Available: 2702; @ qty: 0; Packaging: Cut Tape (CT); Series: GCJ; Part Status: Active; Value: 10µF; Voltage: 10V; Temperature Coefficient: X7R; Operating Temperature: -55°C ~ 125°C; Features: Soft Termination; Ratings: AEC-Q200; Applications: Automotive, Boardflex Sensitive; Mounting Type: Surface Mount, MLCC; Package / Case: 0805 (2012 Metric); Size / Dimension: 0.079" L x 0.049" W (2.00mm x 1.25mm); Height - Seated (Max): -; Thickness (Max): 0.057" (1.45mm); Lead Spacing: -; Lead Style: -
C10 C13 = GCD21BR71H104KA01L: as C1 on sheet stepper_motodriver; Datasheets: http://www.murata.com/~/media/webrenewal/support/library/catalog/products/capacitor/mlcc/c03e.ashx; Image: //media.digikey.com/Renders/Murata%20Renders/0805%28GxM6%29.jpg; Digi-Key Part Number: 490-11955-1-ND; Part Number: GCD21BR71H104KA01L; Quantity Available: 157; @ qty: 0; Packaging: Cut Tape (CT); Series: GCD; Part Status: Active; Value: 0.10µF; Voltage: 50V; Temperature Coefficient: X7R; Operating Temperature: -55°C ~ 125°C; Features: -; Ratings: AEC-Q200; Applications: Automotive; Mounting Type: Surface Mount, MLCC; Package / Case: 0805 (2012 Metric); Size / Dimension: 0.079" L x 0.049" W (2.00mm x 1.25mm); Height - Seated (Max): -; Thickness (Max): 0.049" (1.25mm); Lead Spacing: -; Lead Style: -
C11 = 865080143009: WCAP-ASLI SMT Aluminum Electrolytic Capacitors, D6.3mm x L5.5mm, 220uF, +/-20%, 6.3VDC; Dissipation Factor: 24%; Endurance: 2000h; Leakage Current: 13.86uA; Ripple Current max.: 240mA; Technical Reference: ASED055221M6R3DVCTBB000; ComponentLink1Description: Manufacturer; ComponentLink1URL: http://www.we-online.de; ComponentLink2Description: Datasheet; ComponentLink2URL: https://katalog.we-online.com/pbs/datasheet/865080143009.pdf; Length: 5.5mm; Mounting Technology: SMT; Operating Temperature: -55 to +105degC; Packaging: Tape and Reel; Published Date: August 2019; Capacitance: 220uF; Diameter: 6.3mm; Part Number: 865080143009; Publisher: Wurth Elektronik; Capacitance Tolerance: +/-20%; Rated Voltage: 6.3VDC
C16 = GRM21BR71C334KA01L: CAP CER 0.33UF 16V X7R 0805; Manufacturer: Murata Electronics North America; Factory Stock: 0; Unit Price (USD): 0.25; Minimum Quantity: 1; Tolerance: ±10%; Datasheets: http://www.murata.com/~/media/webrenewal/support/library/catalog/products/capacitor/mlcc/c02e.pdf; Image: //media.digikey.com/Renders/Murata%20Renders/0805%20(2012%20Metric)%20.85mm.jpg; Digi-Key Part Number: 490-9752-1-ND; Part Number: GRM21BR71C334KA01L; Quantity Available: 4512; @ qty: 0; Packaging: Cut Tape (CT); Series: GRM; Part Status: Active; Value: 0.33µF; Voltage: 16V; Temperature Coefficient: X7R; Operating Temperature: -55°C ~ 125°C; Features: -; Ratings: -; Applications: General Purpose; Mounting Type: Surface Mount, MLCC; Package / Case: 0805 (2012 Metric); Size / Dimension: 0.079" L x 0.049" W (2.00mm x 1.25mm); Height - Seated (Max): -; Thickness (Max): 0.053" (1.35mm); Lead Spacing: -; Lead Style: -
C17 = GCM2165C1H471JA16D: CAP CER 470PF 50V NP0 0805; Manufacturer: Murata Electronics North America; Factory Stock: 0; Unit Price (USD): 0.24; Minimum Quantity: 1; Tolerance: ±5%; Temperature Coefficient: C0G, NP0; Datasheets: http://www.murata.com/~/media/webrenewal/support/library/catalog/products/capacitor/mlcc/c03e.ashx; Image: //media.digikey.com/Renders/Murata%20Renders/0805%28GxM6%29.jpg; Digi-Key Part Number: 490-6056-1-ND; Part Number: GCM2165C1H471JA16D; Quantity Available: 9612; @ qty: 0; Packaging: Cut Tape (CT); Series: GCM; Part Status: Active; Value: 470pF; Voltage: 50V; Operating Temperature: -55°C ~ 125°C; Features: -; Ratings: AEC-Q200; Applications: Automotive; Mounting Type: Surface Mount, MLCC; Package / Case: 0805 (2012 Metric); Size / Dimension: 0.079" L x 0.049" W (2.00mm x 1.25mm); Height - Seated (Max): -; Thickness (Max): 0.028" (0.70mm); Lead Spacing: -; Lead Style: -
D7 = 1N4148W-V-GS08: Diode; Manufacturer_Name: Vishay; Datasheet Link: https://us.rs-online.com/m/d/a2789c8794cb0c42ced29f2dd8571f3c.pdf; Height: 1.35mm; Manufacturer_Part_Number: 1N4148W-V-GS08; Mouser Part Number: 625-1N4148W-V; Mouser Price/Stock: https://www.mouser.co.uk/ProductDetail/Vishay-Semiconductors/1N4148W-V-GS08?qs=TNTIDjy6APrS%2Fdgq1RSs3A%3D%3D; Arrow Part Number: 1N4148W-V-GS08; Arrow Price/Stock: https://www.arrow.com/en/products/1n4148w-v-gs08/vishay
IC2 = MIC5207: Integrated Circuit; Manufacturer_Name: Microchip; Datasheet Link: https://ww1.microchip.com/downloads/aemDocuments/documents/OTH/ProductDocuments/DataSheets/MIC5207-180mA-Low-Noise-LDO-Regulator-DS20005719B.pdf; Height: 1.3mm; Manufacturer_Part_Number: MIC5207
IC3 = MIC4684BM: Integrated Circuit; Manufacturer_Name: Rochester Electronics; Datasheet Link: https://4donline.ihs.com/images/VipMasterIC/IC/RSEL/RSELS18597/RSELS19923-1.pdf?hkey=EF798316E3902B6ED9A73243A3159BB0; Height: 1.73mm; Manufacturer_Part_Number: MIC4684BM
L1 = 744045680: WE-LQ SMT Inductor, size 1812, 68uH, 0.33A; Manufacturer: Wurth Elektronik; DC Resistance max.: 2.1Ohm; Self Resonant Frequency: 15MHz; Q-Factor: 55; Saturation Current: 0.61A; ComponentLink1Description: Manufacturer; ComponentLink1URL: http://www.we-online.de; ComponentLink2Description: Datasheet; ComponentLink2URL: https://www.we-online.com/catalog/datasheet/744045680.pdf; Operating Temperature: -40 to +125degC; Packaging: Tape and Reel; Published Date: April 2020; Rated Current: 0.33A; Size: 1812; Inductance: 68uH; Manufacturer Part Number: 744045680; Mounting Technology: SMT
R19 R21 = ERJ-6ENF3011V: RES SMD 3.01K OHM 1% 1/8W 0805; Manufacturer: Panasonic Electronic Components; Factory Stock: 0; Unit Price (USD): 0.00729; @ qty: 1500; Minimum Quantity: 1; Power (Watts): 0.125W, 1/8W; Temperature Coefficient: ±100ppm/°C; Part Number: ERJ-6ENF3011V; Datasheets: http://industrial.panasonic.com/www-cgi/jvcr13pz.cgi?E+PZ+3+AOA0002+ERJ6ENF3011V+7+WW; Image: //media.digikey.com/Renders/Panasonic%20Renders/ERJ-0805%20Pkg.jpg; Digi-Key Part Number: P3.01KCCT-ND; Quantity Available: 48603; Packaging: Cut Tape (CT); Series: ERJ; Part Status: Active; Value: 3.01k; Tolerance: ±1%; Composition: Thick Film; Features: Automotive AEC-Q200; Operating Temperature: -55°C ~ 155°C; Package / Case: 0805 (2012 Metric); Supplier Device Package: 0805; Size / Dimension: 0.079" L x 0.049" W (2.00mm x 1.25mm); Height - Seated (Max): 0.028" (0.70mm); Number of Terminations: 2; Failure Rate: -
R20 = ERJ-P6WJ474V: RES SMD 470K OHM 5% 1/2W 0805; Manufacturer: Panasonic Electronic Components; Factory Stock: 0; Unit Price (USD): 0.08237; @ qty: 1500; Minimum Quantity: 1; Power (Watts): 0.5W, 1/2W; Temperature Coefficient: ±200ppm/°C; Part Number: ERJ-P6WJ474V; Datasheets: https://industrial.panasonic.com/cdbs/www-data/pdf/RDA0000/AOA0000C243.pdf; Image: //media.digikey.com/Renders/Panasonic%20Renders/ERJ-0805%20Pkg.jpg; Digi-Key Part Number: P16986CT-ND; Quantity Available: 4950; Packaging: Cut Tape (CT); Series: ERJ; Part Status: Active; Value: 470k; Tolerance: ±5%; Composition: Thick Film; Features: Automotive AEC-Q200, Pulse Withstanding; Operating Temperature: -55°C ~ 155°C; Package / Case: 0805 (2012 Metric); Supplier Device Package: 0805; Size / Dimension: 0.079" L x 0.049" W (2.00mm x 1.25mm); Height - Seated (Max): 0.030" (0.75mm); Number of Terminations: 2; Failure Rate: -
R22 = ERJ-P6WJ103V: RES SMD 10K OHM 5% 1/2W 0805; Manufacturer: Panasonic Electronic Components; Factory Stock: 0; Unit Price (USD): 0.08237; @ qty: 1500; Minimum Quantity: 1; Power (Watts): 0.5W, 1/2W; Temperature Coefficient: ±200ppm/°C; Part Number: ERJ-P6WJ103V; Datasheets: https://industrial.panasonic.com/cdbs/www-data/pdf/RDA0000/AOA0000C243.pdf; Image: //media.digikey.com/Renders/Panasonic%20Renders/ERJ-0805%20Pkg.jpg; Digi-Key Part Number: P16966CT-ND; Quantity Available: 2796; Packaging: Cut Tape (CT); Series: ERJ; Part Status: Active; Value: 10k; Tolerance: ±5%; Composition: Thick Film; Features: Automotive AEC-Q200, Pulse Withstanding; Operating Temperature: -55°C ~ 155°C; Package / Case: 0805 (2012 Metric); Supplier Device Package: 0805; Size / Dimension: 0.079" L x 0.049" W (2.00mm x 1.25mm); Height - Seated (Max): 0.030" (0.75mm); Number of Terminations: 2; Failure Rate: -
TP2 TP3 = pad2: Top Testpoint Pad
Z1 = BAT46ZFILM: Zener Diode; Manufacturer_Name: STMicroelectronics; Datasheet Link: https://datasheet.datasheetarchive.com/originals/distributors/SFDatasheet-5/sf-000113323.pdf; Manufacturer_Part_Number: BAT46ZFILM; Mouser Part Number: 511-BAT46ZFILM; Mouser Price/Stock: https://www.mouser.co.uk/ProductDetail/STMicroelectronics/BAT46ZFILM?qs=jZi1jxfVU96IWb4%2FLHMEiw%3D%3D; Arrow Part Number: BAT46ZFILM; Arrow Price/Stock: https://www.arrow.com/en/products/bat46zfilm/stmicroelectronics?region=nac

## Sheet 7segment.SchDoc
size Letter; SheetNumber: 6; SheetTotal: 22
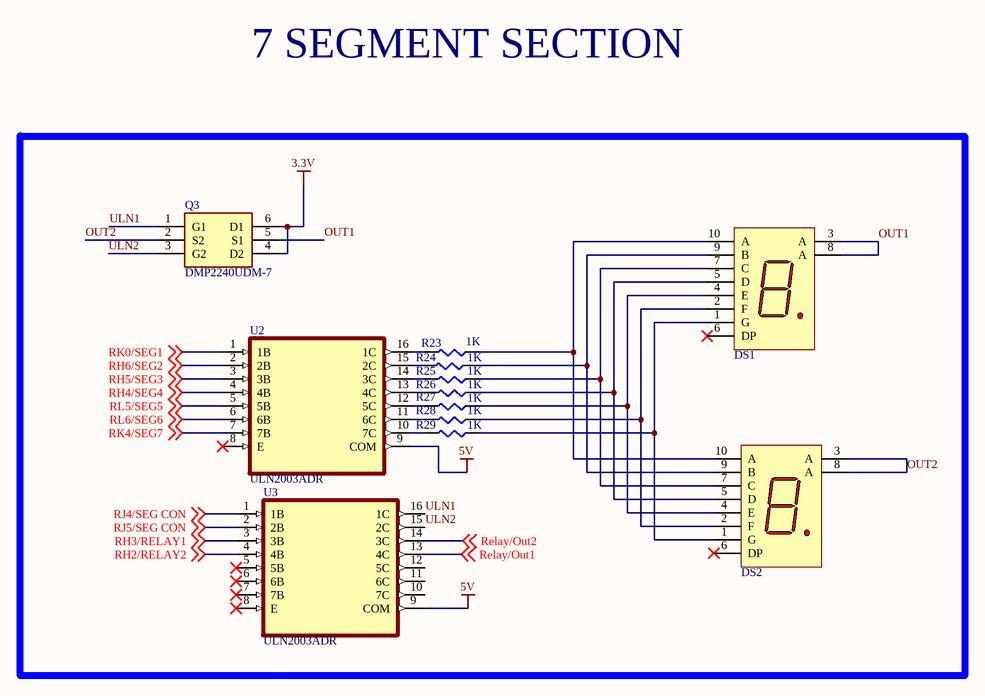
[diagram p5: 7segment.SchDoc]

### Parts
DS1  157119S12801  [WL-T7DS_L13W10H7]  (value not drawn)
DS2  157119S12801  [WL-T7DS_L13W10H7]  (value not drawn)
Q3  DMP2240UDM-7  [SOT95P285X140-6N]
R23  1K  [SMD-0805-RES]
R24  1K  [SMD-0805-RES]
R25  1K  [SMD-0805-RES]
R26  1K  [SMD-0805-RES]
R27  1K  [SMD-0805-RES]
R28  1K  [SMD-0805-RES]
R29  1K  [SMD-0805-RES]
U2  ULN2003ADR  [SOIC127P600X175-16N]
U3  ULN2003ADR  [SOIC127P600X175-16N]

### Nets
3.3V: Q3.4(D2) Q3.6(D1)
5V: U2.9(COM) U3.9(COM)
OUT1: DS1.3(A) DS1.8(A) Q3.5(S1)
OUT2: DS2.3(A) DS2.8(A) Q3.2(S2)
Relay/Out1: U3.13(4C) ; off-sheet Relay/Out1
Relay/Out2: U3.14(3C) ; off-sheet Relay/Out2
RH2/RELAY2: U3.4(4B) ; off-sheet RH2/RELAY2
RH3/RELAY1: U3.3(3B) ; off-sheet RH3/RELAY1
RH4/SEG4: U2.4(4B) ; off-sheet RH4/SEG4
RH5/SEG3: U2.3(3B) ; off-sheet RH5/SEG3
RH6/SEG2: U2.2(2B) ; off-sheet RH6/SEG2
RJ4/SEG CON: U3.1(1B) ; off-sheet RJ4/SEG CON
RJ5/SEG CON: U3.2(2B) ; off-sheet RJ5/SEG CON
RK0/SEG1: U2.1(1B) ; off-sheet RK0/SEG1
RK4/SEG7: U2.7(7B) ; off-sheet RK4/SEG7
RL5/SEG5: U2.5(5B) ; off-sheet RL5/SEG5
RL6/SEG6: U2.6(6B) ; off-sheet RL6/SEG6
ULN1: Q3.1(G1) U3.16(1C)
ULN2: Q3.3(G2) U3.15(2C)
NetDS1_1: DS1.1(G) DS2.1(G) R29.1
NetDS1_2: DS1.2(F) DS2.2(F) R28.1
NetDS1_4: DS1.4(E) DS2.4(E) R27.1
NetDS1_5: DS1.5(D) DS2.5(D) R26.1
NetDS1_7: DS1.7(C) DS2.7(C) R25.1
NetDS1_9: DS1.9(B) DS2.9(B) R24.1
NetDS1_10: DS1.10(A) DS2.10(A) R23.1
NetR23_2: R23.2 U2.16(1C)
NetR24_2: R24.2 U2.15(2C)
NetR25_2: R25.2 U2.14(3C)
NetR26_2: R26.2 U2.13(4C)
NetR27_2: R27.2 U2.12(5C)
NetR28_2: R28.2 U2.11(6C)
NetR29_2: R29.2 U2.10(7C)

Not connected (* = marked no-connect by the designer): DS1 6(DP)*; DS2 6(DP)*; U2 8(E)*; U3 5(5B)* 6(6B)* 7(7B)* 8(E)* 10(7C) 11(6C) 12(5C)

### Notes on the sheet
- 7 SEGMENT SECTION

### Library data of the parts
DS1 DS2 = 157119S12801: WL-T7DS 7 Segments Display THT Single Digit, 0.39"/ 9.9mm, Common Anode, 38mcd, 2V, Super Red; Manufacturer: Wurth Elektronik; ComponentLink1Description: Website Link; ComponentLink1URL: https://www.we-online.com/redexpert/article/157119S12801?ad; ComponentLink2Description: Datasheet Link; ComponentLink2URL: https://www.we-online.com/redexpert/spec/157119S12801?ad; Manufacturer Part Number: 157119S12801; Category: 7 Segments Display; Match Code: WL-T7DS; Mount: Through Hole; Operating Temperature Max: 85°C; Operating Temperature Min: -40°C; Packaging: Tube; Length: 13mm; Width: 10mm; Height: 7mm; Circuitry: Common Anode; Display Height: 0.39"/ 9.9mm; Emitting Color: Super Red; Forward Voltage: 2V; Luminous Intensity: 38mcd
Q3 = DMP2240UDM-7: MOSFET (P-Channel); Manufacturer_Name: Diodes Inc.; Datasheet Link: https://www.diodes.com/assets/Datasheets/ds31197.pdf; Height: 1.4mm; Manufacturer_Part_Number: DMP2240UDM-7; Mouser Part Number: 621-DMP2240UDM-7; Mouser Price/Stock: https://www.mouser.co.uk/ProductDetail/Diodes-Incorporated/DMP2240UDM-7?qs=mno522deGfakW12JLK9H1A%3D%3D; Arrow Part Number: DMP2240UDM-7; Arrow Price/Stock: https://www.arrow.com/en/products/dmp2240udm-7/diodes-incorporated?region=nac
R23-R29 = ERJ-6ENF1001V: as R2 on sheet relaymodule; Part Number: ERJ-6ENF1001V; Datasheets: http://industrial.panasonic.com/www-cgi/jvcr13pz.cgi?E+PZ+3+AOA0002+ERJ6ENF1001V+7+WW; Image: //media.digikey.com/Renders/Panasonic%20Renders/ERJ-0805%20Pkg.jpg; Digi-Key Part Number: P1.00KCCT-ND; Quantity Available: 12895103; Packaging: Cut Tape (CT); Series: ERJ; Part Status: Active; Value: 1k; Tolerance: ±1%; Composition: Thick Film; Features: Automotive AEC-Q200; Operating Temperature: -55°C ~ 155°C; Package / Case: 0805 (2012 Metric); Supplier Device Package: 0805; Size / Dimension: 0.079" L x 0.049" W (2.00mm x 1.25mm); Height - Seated (Max): 0.028" (0.70mm); Number of Terminations: 2; Failure Rate: -
U2 U3 = ULN2003ADR: 50-V, 7-ch darlington transistor array, -20C to 70C; MF: Texas Instruments; Value: *; Check_prices: https://www.snapeda.com/parts/ULN2003ADR/Texas+Instruments/view-part/?ref=eda; Availability: In Stock; Price: None; Package: SOIC-16 Texas Instruments; Purchase-URL: https://pricing.snapeda.com/search/part/ULN2003ADR/?ref=eda; SnapEDA_Link: https://www.snapeda.com/parts/ULN2003ADR/Texas+Instruments/view-part/?ref=snap; MP: ULN2003ADR

## Sheet Rtc.SchDoc
size Letter; SheetNumber: 7; SheetTotal: 23
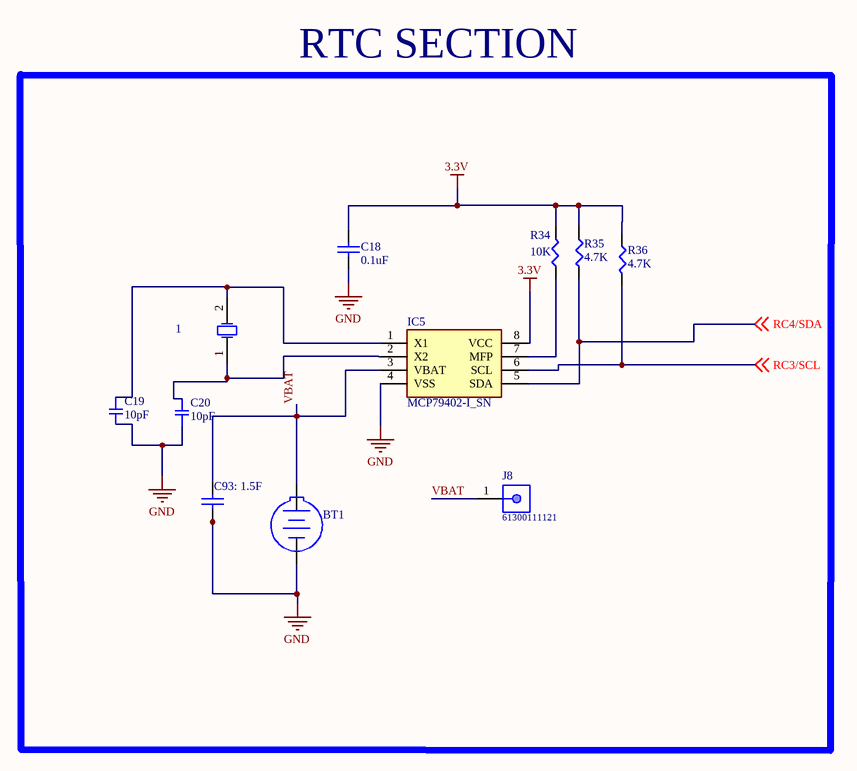
[diagram p6: Rtc.SchDoc]

### Parts
1  (no value)  [Mini Crystal]
BT1  79578211  [79578211]  (value not drawn)
C18  value 0.1uF  [C1206]  (hidden comment: Cap Semi)
C19  10pF  [SMD-0805C]
C20  10pF  [SMD-0805C]
IC5  MCP79402-I_SN  [SOIC127P600X175-8N]
J8  61300111121  [61300111121]
R34  10K  [SMD-0805-RES]
R35  4.7K  [SMD-0805-RES]
R36  4.7K  [SMD-0805-RES]
SuperCap1  C93: 1.5F  [C1206]  (hidden comment: Cap Semi)

### Blocks framed on the sheet
RTC SECTION: 1 BT1 C18-C20 IC5 J8 R34-R36 SuperCap1

### Nets
3.3V: C18.1 IC5.8(VCC) R34.2 R35.1 R36.1
GND: BT1.2(-) C18.2 C19.2 C20.2 IC5.4(VSS) SuperCap1.2
RC3/SCL: IC5.6(SCL) R36.2 ; off-sheet RC3/SCL
RC4/SDA: IC5.5(SDA) R35.2 ; off-sheet RC4/SDA
VBAT: BT1.1(+) IC5.3(VBAT) J8.1 SuperCap1.1
Net1_1: 1.1(X1) C20.1 IC5.2(X2)
Net1_2: 1.2(X2) C19.1 IC5.1(X1)
NetIC5_7: IC5.7(MFP) R34.1

### Library data of the parts
1 = Mini Crystal: 9B-64.000MBBK-B; Manufacturer: Abracon; PartNumber: ABLS2-4.096MHZ-D4Y-T; Operation Mode: Fundamental or 3rd Overtone; Shunt Capacitance: 7 pF Max.; Freq. Stability: +/- 30 ppm; Packing: Tape and Reel; ESR: 180 Ohm; Load Capacitance: 18 pF; Frequency: 4.096 MHz; Mounting Technology: Surface Mount; PackageDescription: 2-Pin SMD, Body 11.4 x 4.7 mm, Height 3.3 mm; ComponentLink1URL: http://www.abracon.com/; ComponentLink2Description: Datasheet; Operating Temp. Range: -40 to 85 degC; RoHS: TRUE; PackageReference: ABLS2-2; DatasheetVersion: Rev. 03.31.11; Freq. Tolerance: +/- 30 ppm; ComponentLink2URL: http://www.abracon.com/Resonators/ABLS2.pdf; ComponentLink1Description: Manufacturer URL
BT1 = 79578211: WA-BCPH Battery Holder, THT, battery type 2450; Manufacturer: Wurth Elektronik; Battery Type: 2450; ComponentLink1Description: Website Link; ComponentLink1URL: https://www.we-online.com/redexpert/article/79578211?ad; ComponentLink2Description: Datasheet Link; ComponentLink2URL: https://www.we-online.com/redexpert/spec/79578211?ad; Manufacturer Part Number: 79578211; Category: Battery Holders; Match Code: WA-BCPH; Mount: Through Hole; Operating Temperature Max: 105°C; Operating Temperature Min: -40°C; Packaging: Bag
C18 SuperCap1 = Cap Semi: Capacitor (Semiconductor SIM Model); Published: 8-Jun-2000; LatestRevisionDate: 29-May-2009; LatestRevisionNote: IPC-7351 Footprint Added.; PackageReference: C1206; Publisher: Altium Limited; PackageDescription: Chip Capacitor
C19 C20 = GCD21BR71H104KA01L: CAP CER 0.1UF 50V X7R 0805; Manufacturer: Murata Electronics North America; Factory Stock: 0; Unit Price (USD): 0.24; Minimum Quantity: 1; Value: 0.10µF; Tolerance: ±10%; Datasheets: http://www.murata.com/~/media/webrenewal/support/library/catalog/products/capacitor/mlcc/c03e.ashx; Image: //media.digikey.com/Renders/Murata%20Renders/0805%28GxM6%29.jpg; Digi-Key Part Number: 490-11955-1-ND; Part Number: GCD21BR71H104KA01L; Quantity Available: 157; @ qty: 0; Packaging: Cut Tape (CT); Series: GCD; Part Status: Active; Voltage: 50V; Temperature Coefficient: X7R; Operating Temperature: -55°C ~ 125°C; Features: -; Ratings: AEC-Q200; Applications: Automotive; Mounting Type: Surface Mount, MLCC; Package / Case: 0805 (2012 Metric); Size / Dimension: 0.079" L x 0.049" W (2.00mm x 1.25mm); Height - Seated (Max): -; Thickness (Max): 0.049" (1.25mm); Lead Spacing: -; Lead Style: -
IC5 = MCP79402-I_SN: Integrated Circuit; Manufacturer_Name: Microchip; Manufacturer_Part_Number: MCP79402-I/SN; Datasheet Link: https://componentsearchengine.com/Datasheets/2/MCP79402-I_SN.pdf; Height: 1.75mm; Mouser Part Number: 579-MCP79402ISN; Mouser Price/Stock: https://www.mouser.co.uk/ProductDetail/Microchip-Technology-Atmel/MCP79402-I-SN?qs=ggQiQSXuoRVK%2FFI6ElTaZQ%3D%3D; Arrow Part Number: MCP79402-I/SN; Arrow Price/Stock: https://www.arrow.com/en/products/mcp79402-isn/microchip-technology
J8 = 61300111121: WR-PHD Pin Header, THT, pitch 2.54mm, Single Row, Vertical, 1pin; Pin Number: 1; Gender: Male; Rated Current: 3A; Working Voltage: 250VAC; Withstanding Voltage: 500VAC; Contact Resistance: 20mOhm; ComponentLink1Description: Manufacturer; ComponentLink1URL: http://www.we-online.de; ComponentLink2Description: Datasheet; ComponentLink2URL: https://katalog.we-online.de/em/datasheet/6130xx11121.pdf; Part Number: 61300111121; Published Date: June 2019; Publisher: Wurth Elektronik; Pitch: 2.54mm; Operating Temperature: -40 to +105degC; Mounting Technology: THT; Packaging: Bag; Row Number: Single; Orientation: Vertical
R34-R36 = ERJ-6ENF1001V: as R2 on sheet relaymodule; Part Number: ERJ-6ENF1001V; Datasheets: http://industrial.panasonic.com/www-cgi/jvcr13pz.cgi?E+PZ+3+AOA0002+ERJ6ENF1001V+7+WW; Image: //media.digikey.com/Renders/Panasonic%20Renders/ERJ-0805%20Pkg.jpg; Digi-Key Part Number: P1.00KCCT-ND; Quantity Available: 12895103; Packaging: Cut Tape (CT); Series: ERJ; Part Status: Active; Value: 1k; Tolerance: ±1%; Composition: Thick Film; Features: Automotive AEC-Q200; Operating Temperature: -55°C ~ 155°C; Package / Case: 0805 (2012 Metric); Supplier Device Package: 0805; Size / Dimension: 0.079" L x 0.049" W (2.00mm x 1.25mm); Height - Seated (Max): 0.028" (0.70mm); Number of Terminations: 2; Failure Rate: -